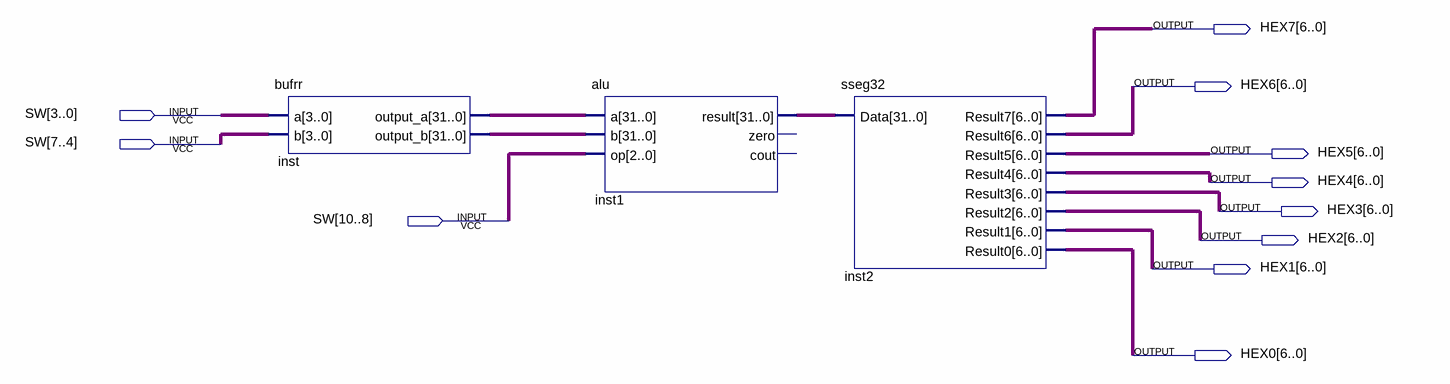
[diagram p0: schematic sheet]
// Quartus schematic block.bdf as structural Verilog: 3 symbols, 11 pins
module block (
  input  [10:0] SW,
  output [6:0] HEX7,
  output [6:0] HEX6,
  output [6:0] HEX5,
  output [6:0] HEX4,
  output [6:0] HEX3,
  output [6:0] HEX2,
  output [6:0] HEX1,
  output [6:0] HEX0
);

  wire [31:0] inst1_result, inst_output_a, inst_output_b;

  bufrr inst (.a(SW[3:0]), .b(SW[7:4]), .output_a(inst_output_a), .output_b(inst_output_b));
  alu inst1 (.a(inst_output_a), .b(inst_output_b), .op(SW[10:8]), .result(inst1_result));  // open: zero, cout
  sseg32 inst2 (
    .Data(inst1_result), .Result7(HEX7), .Result6(HEX6), .Result5(HEX5), .Result4(HEX4), .Result3(HEX3),
    .Result2(HEX2), .Result1(HEX1), .Result0(HEX0));
endmodule
